# EasyEDA Pro project digiport-gerneral.epro

# Schematic Schematic1
Board Name: digiport-gerneral; Create Date: 2025-06-11; Page Name: P1; Project Name: digiport-general; Schematic Name: Schematic1; Update Date: 2025-06-11; Company: 嘉立创EDA; Page Size: A4; Version: V1.0
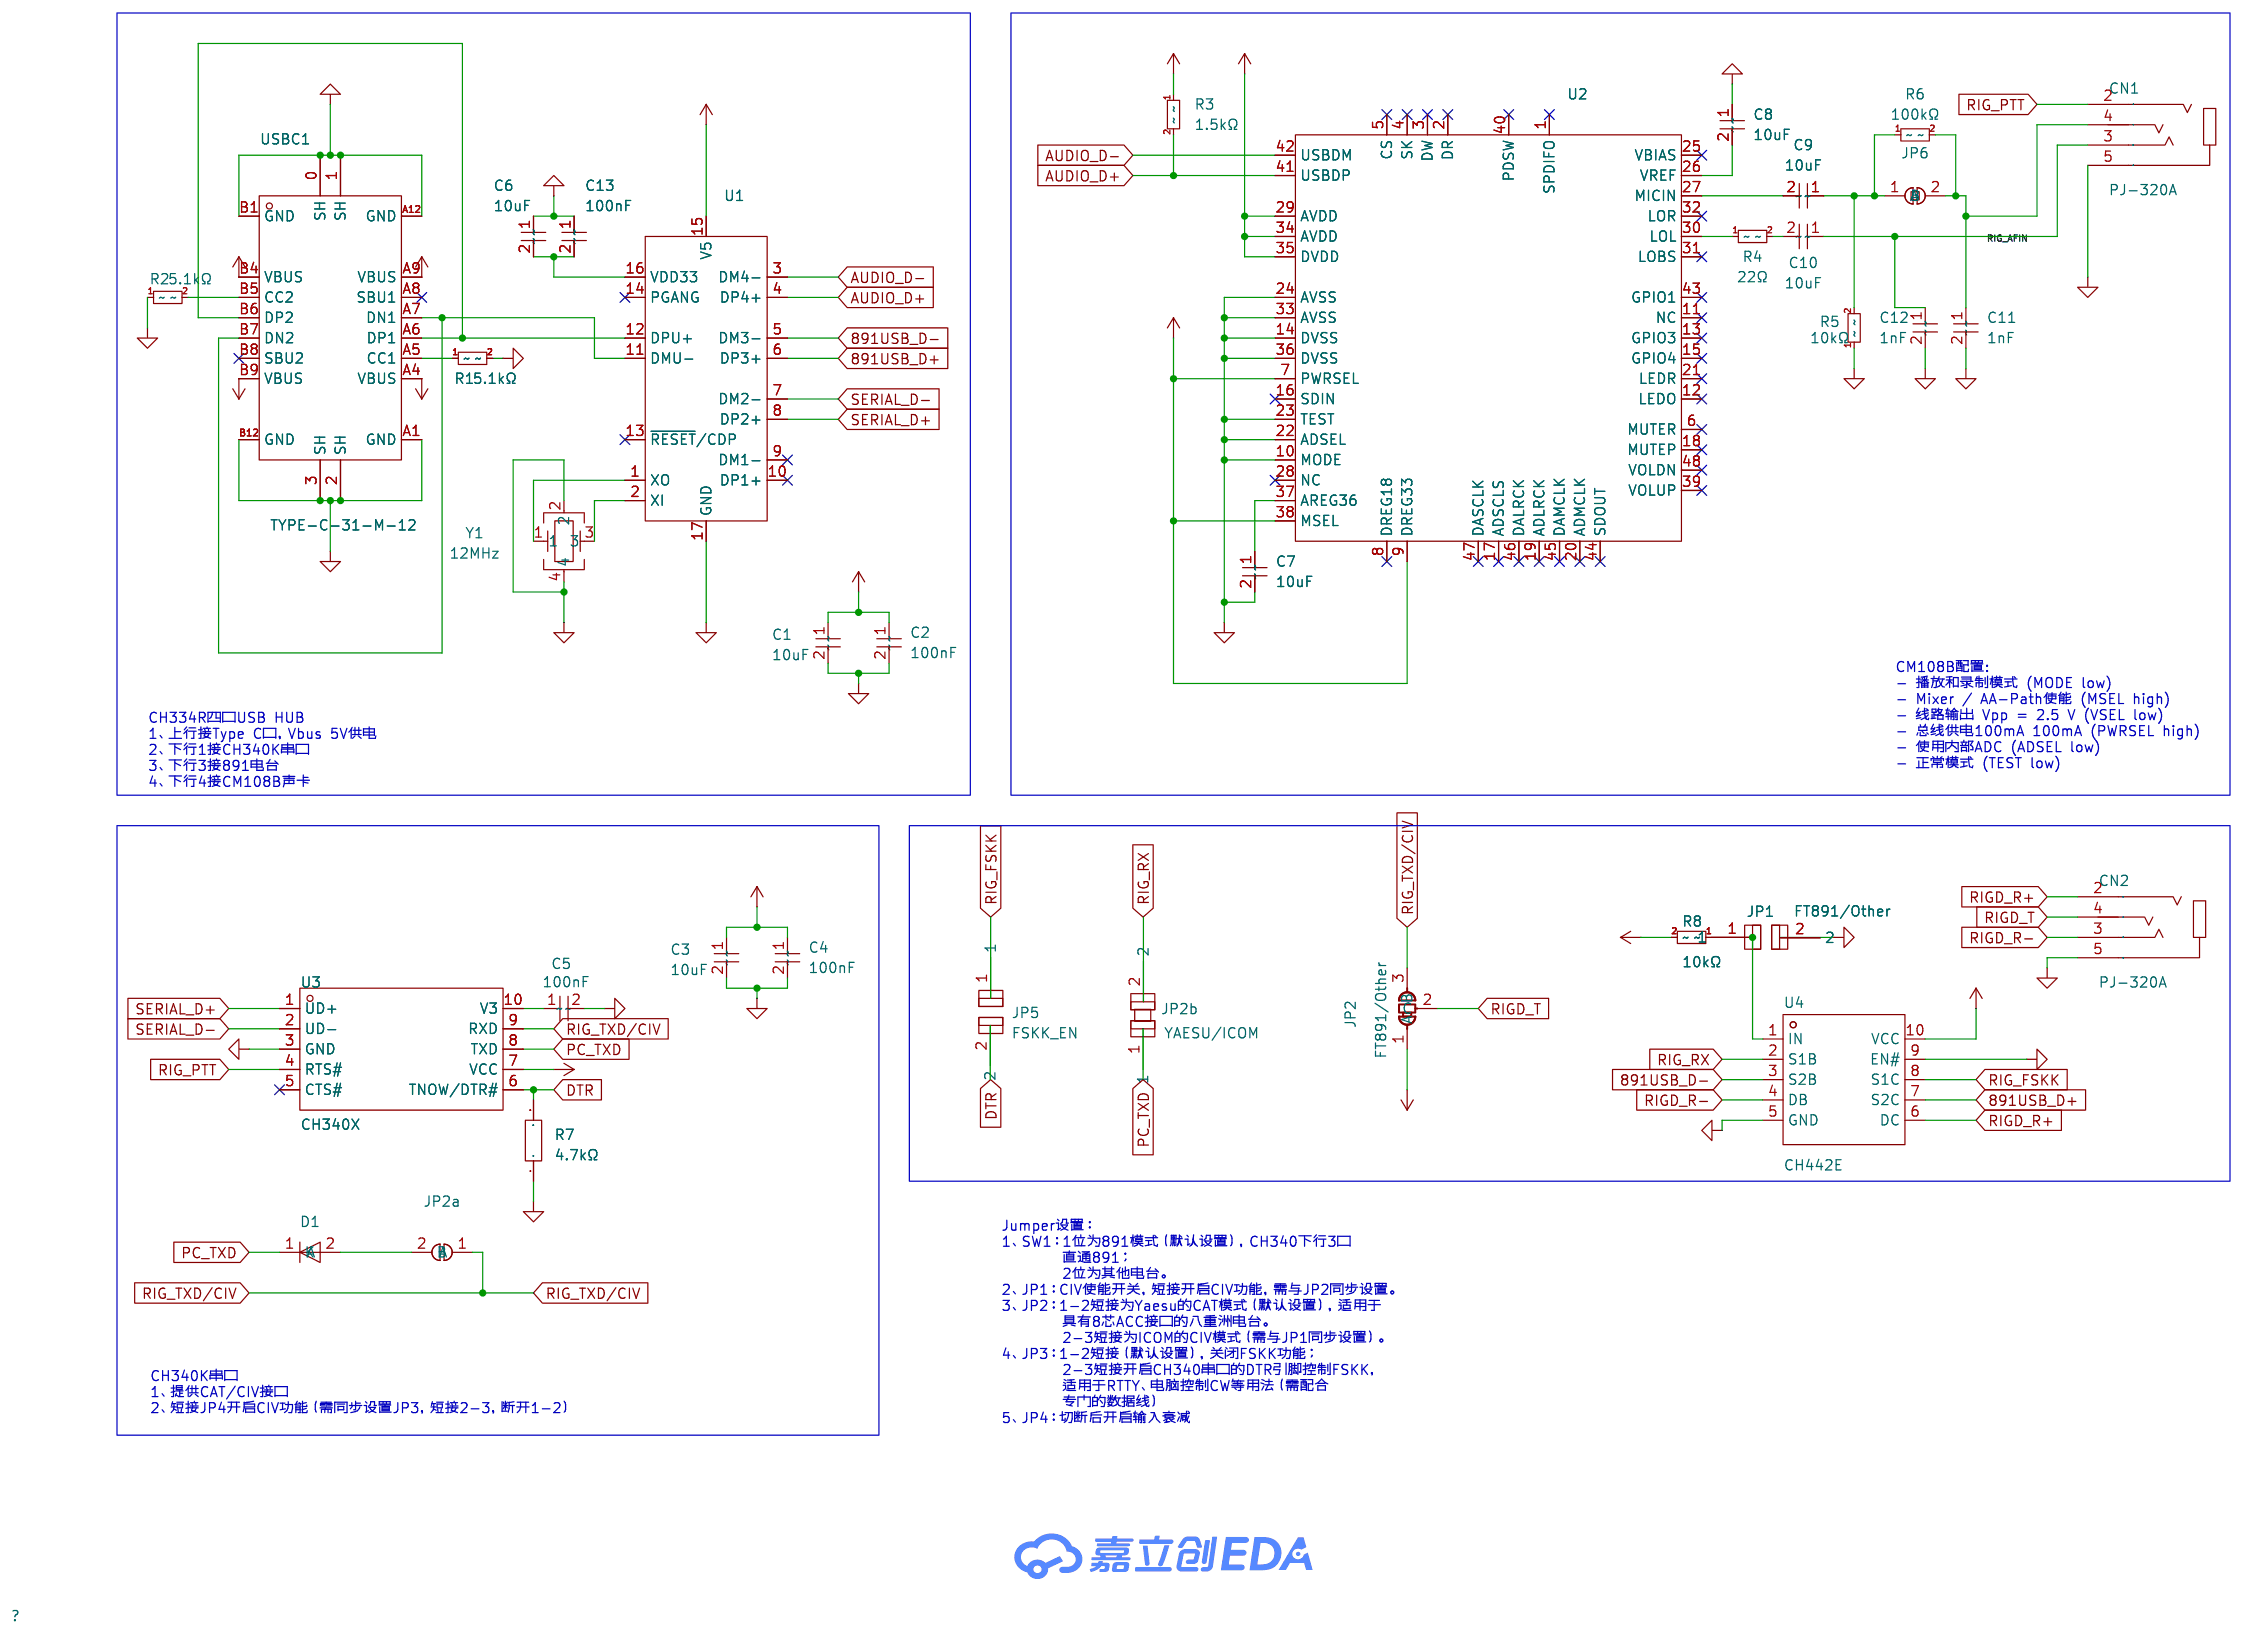
[diagram p0: schematic sheet]

## Parts
C1  10uF  [C0603]
C2  100nF  [C0603]
C3  10uF  [C0603]
C4  100nF  [C0603]
C5  100nF  [C0603]
C6  10uF  [C0603]
C7  10uF  [C0603]
C8  10uF  [C0603]
C9  10uF  [C0603]
C10  10uF  [C0603]
C11  1nF  [C0603]
C12  1nF  [C0603]
C13  100nF  [C0603]
CN1  PJ-320A  [AUDIO-TH_XKB_PJ-320A]
CN2  PJ-320A  [AUDIO-TH_XKB_PJ-320A]
D1  1N4148W-E3-18  [SOD-123_L2.7-W1.6-LS3.7-FD]
JP1  FT891/Other  [SolderJumper2_Open]  (no BOM)
JP2  FSKK_EN  [SolderJumpers3_1&2Bridged]  (no BOM)
JP2a  -  [SolderJumper2_Open]
JP2b  YAESU/ICOM  [SolderJumper2-Bridged]  (no BOM)
JP5  FSKK_EN  [SolderJumper2_Open]  (no BOM)
JP6  -  [SolderJumper2-Bridged]  (no BOM)
R1  5.1kΩ  [R0603]
R2  5.1kΩ  [R0603]
R3  1.5kΩ  [R0603]
R4  22Ω  [R0603]
R5  10kΩ  [R0603]
R6  100kΩ  [R0603]
R7  4.7kΩ  [R0603]
R8  10kΩ  [R0603]
U1  CH334P  [QFN-16_L3.0-W3.0-P0.50-BL-EP1.7]
U2  CM108B  [LQFP-48_L7.0-W7.0-P0.50-LS9.0-BL]
U3  CH340X  [MSOP-10_L3.0-W3.0-P0.50-LS5.0-BL]
U4  CH442E  [MSOP-10_L3.0-W3.0-P0.50-LS5.0-BL]
USBC1  TYPE-C-31-M-12  [USB-C_SMD-TYPE-C-31-M-12]
Y1  12MHz  [CRYSTAL-SMD_4P-L3.2-W2.5-BL]

## Library data of the parts
C1 C3 C6-C10 = GRM188R61E106KA73D: 容值:10uF;精度:±10%;额定电压:25V;材质(温度系数):X5R;; LCSC Part Name: 10uF ±10% 25V; Supplier Part: C344022; Manufacturer: muRata(村田); Supplier Footprint: 0603; JLCPCB Part Class: Extended Part; Datasheet: https://atta.szlcsc.com/upload/public/pdf/source/20181211/C344022_BB98D43E7DA95E5A749FBFE073C8A3E0.pdf; Supplier: LCSC; Tolerance: ±10%; Voltage Rated: 25V; Temperature Coefficient: X5R
C2 C4 C5 C13 = GCJ188R91H104KA01D: 容值:100nF;精度:±10%;额定电压:50V;材质(温度系数):X8R;; LCSC Part Name: 100nF ±10% 50V; Supplier Part: C437421; Manufacturer: muRata(村田); Supplier Footprint: 0603; JLCPCB Part Class: Extended Part; Datasheet: https://atta.szlcsc.com/upload/public/pdf/source/20191016/C437421_7C8D315537458CC8934150722EE6B68F.pdf; Supplier: LCSC; Tolerance: ±10%; Voltage Rated: 50V; Temperature Coefficient: X8R
C11 C12 = GRM1885C1H102JA01D: 容值:1nF;精度:±5%;额定电压:50V;材质(温度系数):C0G;; LCSC Part Name: 1nF ±5% 50V; Supplier Part: C77026; Manufacturer: muRata(村田); Supplier Footprint: 0603; JLCPCB Part Class: Extended Part; Datasheet: https://atta.szlcsc.com/upload/public/pdf/source/20200305/C490387_23319AE8C154DEB24C505E6C82A8106A.pdf; Supplier: LCSC; Tolerance: ±5%; Voltage Rated: 50V; Temperature Coefficient: C0G
CN1 CN2 = PJ-320A: 连接器类型:3.5mm耳机座;额定电流:500mA;额定电压:30V;工作温度范围:-20℃~+70℃;焊接温度(最大值):235℃;; LCSC Part Name: 3.5mm耳机座; Supplier Part: C2884926; Manufacturer: XKB Connectivity(中国星坤); Supplier Footprint: 插件; JLCPCB Part Class: Extended Part; Datasheet: https://atta.szlcsc.com/upload/public/pdf/source/20211009/3530D3239D5E54DF713226555EC23A50.pdf; Supplier: LCSC; Connector Type: 3.5mm耳机座; Current Rating (Max): 500mA; Voltage Rating (Max): 30V; Operating Temperature Range: -20℃~+70℃; Soldering Temperature(Max): 235℃
D1 = 1N4148W-E3-18: 二极管配置:-;正向压降(Vf):1.2V@100mA;直流反向耐压(Vr):75V;平均整流电流(Io):150mA;功率:350mW;反向恢复时间(trr):4ns;; LCSC Part Name: 电压:75V 电流:150mA; Supplier Part: C191428; Manufacturer: VISHAY(威世); Supplier Footprint: SOD-123; JLCPCB Part Class: Extended Part; Datasheet: https://atta.szlcsc.com/upload/public/pdf/source/20180503/C191428_AD0ED457CC768099CBC92C1868282AFA.pdf; Supplier: LCSC; Forward Voltage (Vf@If): 1.2V@100mA; Reverse Voltage (Vr): 75V; Average Rectified Current (Io): 150mA; Power Dissipation: 350mW; Reverse Leakage Current: 100uA@100V; Reverse Recovery Time (trr): 4ns
JP1 JP2a JP5 = SolderJumper2-Open
JP2 = Jumper_SolderJumper_3_Bridged12
JP2b JP6 = SolderJumper2-Bridged
R1 R2 = ERA3AEB512V: 电阻类型:薄膜电阻;阻值:5.1kΩ;精度:±0.1%;功率:100mW;最大工作电压:75V;温度系数:±25ppm/℃;; LCSC Part Name: 5.1kΩ ±0.1% 100mW 薄膜电阻; Supplier Part: C473240; Manufacturer: PANASONIC(松下); Supplier Footprint: 0603; JLCPCB Part Class: Extended Part; Datasheet: https://atta.szlcsc.com/upload/public/pdf/source/20200407/C473240_5B16E09348C571B2A598AE346C03F608.pdf; Supplier: LCSC; Type: 薄膜电阻; Tolerance: ±0.1%; Power(Watts): 100mW; Overload Voltage (Max): 75V; Temperature Coefficient: ±25ppm/℃; Operating Temperature Range: -55℃~+155℃
R3 = ERA3AEB152V: 电阻类型:薄膜电阻;阻值:1.5kΩ;精度:±0.1%;功率:100mW;最大工作电压:75V;温度系数:±25ppm/℃;; LCSC Part Name: 1.5kΩ ±0.1% 100mW 薄膜电阻; Supplier Part: C491115; Manufacturer: PANASONIC(松下); Supplier Footprint: 0603; JLCPCB Part Class: Extended Part; Datasheet: https://atta.szlcsc.com/upload/public/pdf/source/20200407/C491115_63636A060D3E7218AF9C959CC7F7D318.pdf; Supplier: LCSC; Type: 薄膜电阻; Tolerance: ±0.1%; Power(Watts): 100mW; Overload Voltage (Max): 75V; Temperature Coefficient: ±25ppm/℃; Operating Temperature Range: -55℃~+155℃
R4 = ERJPA3F22R0V: 电阻类型:厚膜电阻;阻值:22Ω;精度:±1%;功率:333mW;最大工作电压:-;温度系数:±100ppm/℃;; LCSC Part Name: 22Ω ±1% 333mW 厚膜电阻; Supplier Part: C441911; Manufacturer: PANASONIC(松下); Supplier Footprint: 0603; JLCPCB Part Class: Extended Part; Supplier: LCSC; Type: 厚膜电阻; Tolerance: ±1%; Power(Watts): 333mW; Temperature Coefficient: ±100ppm/℃; Operating Temperature Range: -55℃~+155℃
R5 R8 = ERA3ARB103V: 电阻类型:薄膜电阻;阻值:10kΩ;精度:±0.1%;功率:100mW;最大工作电压:75V;温度系数:±10ppm/℃;; LCSC Part Name: 10kΩ ±0.1% 100mW 薄膜电阻; Supplier Part: C465746; Manufacturer: PANASONIC(松下); Supplier Footprint: 0603; JLCPCB Part Class: Extended Part; Datasheet: https://atta.szlcsc.com/upload/public/pdf/source/20240116/1BF74EFD9CB3CD3C2EC733065CE8BC8C.pdf; Supplier: LCSC; Type: 薄膜电阻; Tolerance: ±0.1%; Power(Watts): 100mW; Overload Voltage (Max): 75V; Temperature Coefficient: ±10ppm/℃; Operating Temperature Range: -55℃~+155℃
R6 = ERJ3EKF1003V: 电阻类型:厚膜电阻;阻值:100kΩ;精度:±1%;功率:100mW;最大工作电压:-;温度系数:±100ppm/℃;; LCSC Part Name: 100kΩ ±1% 100mW 厚膜电阻; Supplier Part: C189597; Manufacturer: PANASONIC(松下); Supplier Footprint: 0603; JLCPCB Part Class: Extended Part; Datasheet: https://atta.szlcsc.com/upload/public/pdf/source/20180524/C193239_FFEA89BB7F9859C8C42240F47AD03C60.pdf; Supplier: LCSC; Type: 厚膜电阻; Tolerance: ±1%; Power(Watts): 100mW; Temperature Coefficient: ±100ppm/℃; Operating Temperature Range: -55℃~+155℃
R7 = ERJPB3B4701V: 电阻类型:厚膜电阻;阻值:4.7kΩ;精度:±0.1%;功率:250mW;最大工作电压:-;温度系数:±50ppm/℃;; LCSC Part Name: 4.7kΩ ±0.1% 250mW 厚膜电阻; Supplier Part: C413738; Manufacturer: PANASONIC(松下); Supplier Footprint: 0603; JLCPCB Part Class: Extended Part; Datasheet: https://atta.szlcsc.com/upload/public/pdf/source/20190821/C413738_E57543BB27A9F77C5AB4607F62EE6601.pdf; Supplier: LCSC; Type: 厚膜电阻; Tolerance: ±0.1%; Power(Watts): 250mW; Temperature Coefficient: ±50ppm/℃; Operating Temperature Range: -55℃~+155℃
U1 = CH334P: CH334和CH335是符合USB2.0协议规范的4端口USBHUB控制器芯片，上行端口支持USB2.0高速和全速，下行端口支持USB2.0高速480Mbps、全速12Mbps和低速1.5Mbps。; Supplier Part: C5373042; Manufacturer: WCH(南京沁恒); Supplier Footprint: QFN-16(3x3); JLCPCB Part Class: Extended Part; Datasheet: https://atta.szlcsc.com/upload/public/pdf/source/20230505/F9D05933C283E82A0686C9413889129E.pdf; Supplier: LCSC; type: 集线器; Protocol: USB 2.0; Data Rate: 480Mbps; Supply Voltage: 3.3V; Operating Temperature: -40℃~+85℃
U2 = CM108B: 高度集成的USB音频芯片 Crystal-less USB audio codec with I2S I/O and Xear driver; LCSC Part Name: Audio Converter Chip; Supplier Part: C371347; Manufacturer: Cmedia(骅讯); Supplier Footprint: LQFP-48(7x7); JLCPCB Part Class: Extended Part; Datasheet: https://atta.szlcsc.com/upload/public/pdf/source/20190215/C371347_139780418F8DFE40697A24CD62AD2CE5.pdf; Supplier: LCSC
U3 = CH340X: Supplier Part: C3035748; Manufacturer: WCH(南京沁恒); Supplier Footprint: MSOP-10; JLCPCB Part Class: 扩展库; Datasheet: https://atta.szlcsc.com/upload/public/pdf/source/20230530/6E401E9554E9F5311886CC8B3F89B62E.pdf; Supplier: LCSC
U4 = CH442E: 开关电路:双刀双掷(DPDT);通道数:2;导通电阻(Ron@VCC):16Ω;; LCSC Part Name: 双刀双掷5V低阻模拟开关芯片CH442E; Supplier Part: C150097; Manufacturer: WCH(南京沁恒); Supplier Footprint: MSOP-10; JLCPCB Part Class: 扩展库; Datasheet: https://atta.szlcsc.com/upload/public/pdf/source/20240313/620B938073BDDE47F846FA583072617B.pdf; Supplier: LCSC; Switch Circuit: 双刀双掷(DPDT); Number of Channels: 2; Supply Voltage: 4V~5.5V; Turn-on time: 7ns; On-State Resistance (Max): 16Ω; Turn-off time: 7ns; Operating Temperature: -40℃~+85℃
USBC1 = TYPE-C-31-M-12: 连接器类型:Type-C;标准:-;公母:母;安装方式:-;触点数量:16P;端口数量:1;额定电流 - 电源:5A;工作温度范围:-;; LCSC Part Name: Type-C 母; Supplier Part: C165948; Manufacturer: 韩国韩荣; Supplier Footprint: SMD; JLCPCB Part Class: Extended Part; Datasheet: https://atta.szlcsc.com/upload/public/pdf/source/20220525/466408E853115E789EDB0DDC29077C05.pdf; Supplier: LCSC; Connector Type: Type-C; Gender: 母; Number of Contacts: 16P; Number of Ports: 1; Current Rating - Power (Max): 5A
Y1 = CF4012M00012001: 晶振类型:贴片晶振;频率:12MHz;常温频差:±10ppm;负载电容:12pF;频率稳定度:±30ppm;; LCSC Part Name: 12MHz ±10ppm 12pF; Supplier Part: C7294550; Manufacturer: HUAXIN(华昕); Supplier Footprint: SMD-3225-4P; JLCPCB Part Class: Extended Part; Datasheet: https://atta.szlcsc.com/upload/public/pdf/source/20230614/3722586679DD390FF3DAA05DC65F5BC0.pdf; Supplier: LCSC; Type: 贴片晶振; Normal temperature Frequency Tolerance: ±10ppm; Load Capacitance: 12pF; Frequency Stability: ±30ppm; Equivalent Series Resistance(ESR): 40Ω; Operating Temperature: -40℃~+85℃

## Nets
891USB_D+: U1.6(DP3+) U4.7(S2C)
891USB_D-: U1.5(DM3-) U4.3(S2B)
AUDIO_D+: R3.2 U1.4(DP4+) U2.41(USBDP)
AUDIO_D-: U1.3(DM4-) U2.42(USBDM)
DTR: JP5.2 R7.2 U3.6(TNOW/DTR#)
PC_TXD: D1.1(K) JP2b.1 U3.8(TXD)
POWER_+3.3V: C3.1 C4.1 R3.1 U2.7(PWRSEL) U2.9(DREG33) U2.38(MSEL)
POWER_+5V: C1.1 C2.1 JP2.1(A) R8.2 U1.15(V5) U2.29(AVDD) U2.34(AVDD) U2.35(DVDD) U3.7(VCC) U4.10(VCC) USBC1.A4(VBUS) USBC1.A9(VBUS) USBC1.B4(VBUS) USBC1.B9(VBUS)
POWER_GND: C1.2 C2.2 C3.2 C4.2 C5.2 C6.1 C7.2 C8.1 C11.2 C12.2 C13.1 CN1.5 CN2.5 R1.2 R2.1 R5.1 R7.1 U1.17(GND) U2.10(MODE) U2.14(DVSS) U2.22(ADSEL) U2.23(TEST) U2.24(AVSS) U2.33(AVSS) U2.36(DVSS) U3.3(GND) U4.5(GND) U4.9(EN#) USBC1.0(SH) USBC1.1(SH) USBC1.2(SH) USBC1.3(SH) USBC1.A1(GND) USBC1.A12(GND) USBC1.B1(GND) USBC1.B12(GND) Y1.2 Y1.4
RIG_AFIN: C10.1 C12.1 CN1.3
RIG_FSKK: JP5.1 U4.8(S1C)
RIG_PTT: CN1.2 U3.4(RTS#)
RIG_RX: JP2b.2 U4.2(S1B)
RIG_TXD/CIV: JP2.3(B) JP2a.1(A) U3.9(RXD)
RIGD_R+: CN2.2 U4.6(DC)
RIGD_R-: CN2.3 U4.4(DB)
RIGD_T: CN2.4 JP2.2(C)
SERIAL_D+: U1.8(DP2+) U3.1(UD+)
SERIAL_D-: U1.7(DM2-) U3.2(UD-)
$1N2280: C6.2 C13.2 U1.16(VDD33)
$1N2319: C8.2 U2.26(VREF)
$1N2326: C11.1 CN1.4 JP6.2(B) R6.2
$1N2338: C7.1 U2.37(AREG36)
$1N2355: C9.1 JP6.1(A) R5.2 R6.1
$1N2364: D1.2(A) JP2a.2(B)
$1N2394: U1.1(XO) Y1.1
$1N2405: U1.2(XI) Y1.3
$1N2431: R4.1 U2.30(LOL)
$1N2435: C9.2 U2.27(MICIN)
$1N2439: C5.1 U3.10(V3)
$1N2449: C10.2 R4.2
$1N2474: U1.12(DPU+) USBC1.A6(DP1) USBC1.B6(DP2)
$1N2475: R2.2 USBC1.B5(CC2)
$1N2477: R1.1 USBC1.A5(CC1)
$1N2478: U1.11(DMU-) USBC1.A7(DN1) USBC1.B7(DN2)
$1N8912: JP1.1 R8.1 U4.1(IN)

Not connected (* = marked no-connect by the designer): JP1 2; U1 9(DM1-)* 10(DP1+)* 13(~{RESET}/CDP)* 14(PGANG)*; U2 1(SPDIFO)* 2(DR)* 3(DW)* 4(SK)* 5(CS)* 6(MUTER)* 8(DREG18)* 11(NC)* 12(LEDO)* 13(GPIO3)* 15(GPIO4)* 16(SDIN)* 17(ADSCLS)* 18(MUTEP)* 19(ADLRCK)* 20(ADMCLK)* 21(LEDR)* 25(VBIAS)* 28(NC)* 31(LOBS)* 32(LOR)* 39(VOLUP)* 40(PDSW)* 43(GPIO1)* 44(SDOUT)* 45(DAMCLK)* 46(DALRCK)* 47(DASCLK)* 48(VOLDN)*; U3 5(CTS#)*; USBC1 A8(SBU1)* B8(SBU2)*

## Notes on the sheet
- CM108B配置:
  - 播放和录制模式 (MODE low)
  - Mixer / AA-Path使能 (MSEL high)
  - 线路输出 Vpp = 2.5 V (VSEL low)
  - 总线供电100mA 100mA (PWRSEL high)
  - 使用内部ADC (ADSEL low)
  - 正常模式 (TEST low)
- CH334R四口USB HUB
  1、上行接Type C口，Vbus 5V供电
  2、下行1接CH340K串口
  3、下行3接891电台
  4、下行4接CM108B声卡
- Jumper设置：
  1、SW1：1位为891模式（默认设置），CH340下行3口
          直通891；
          2位为其他电台。
  2、JP1：CIV使能开关，短接开启CIV功能，需与JP2同步设置。
  3、JP2：1-2短接为Yaesu的CAT模式（默认设置），适用于
          具有8芯ACC接口的八重洲电台。
          2-3短接为ICOM的CIV模式（需与JP1同步设置）。
  4、JP3：1-2短接（默认设置），关闭FSKK功能；
          2-3短接开启CH340串口的DTR引脚控制FSKK，
          适用于RTTY、电脑控制CW等用法（需配合
          专门的数据线）
  5、JP4：切断后开启输入衰减
- CH340K串口
  1、提供CAT/CIV接口
  2、短接JP4开启CIV功能（需同步设置JP3，短接2-3，断开1-2）

# Board digiport-gerneral
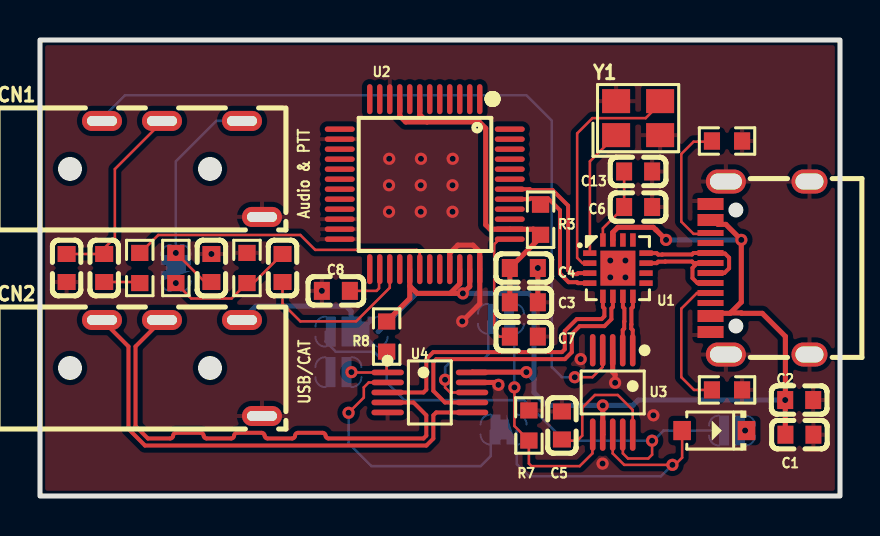
[diagram p1: board, top side]
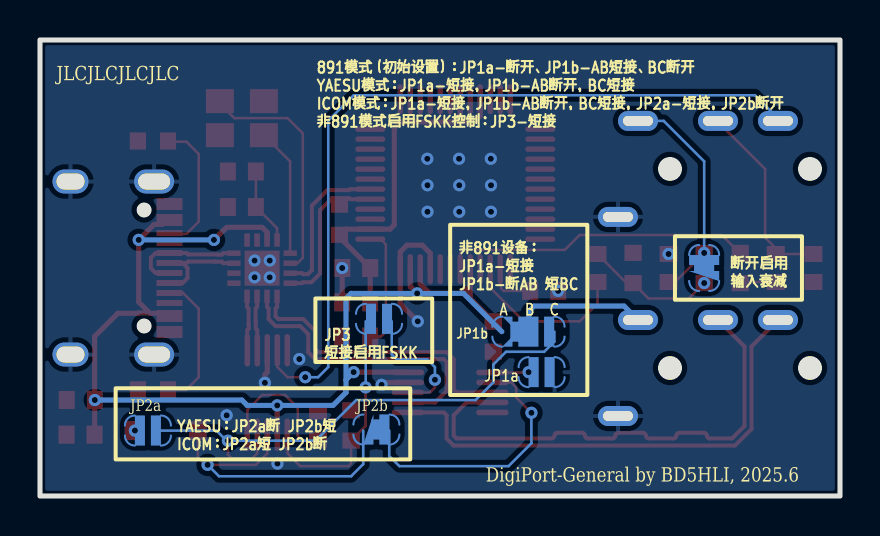
[diagram p2: board, bottom side, seen from below]

Outline 40 x 22.8 mm; copper layers: Top Layer, Bottom Layer. Coordinates in mm from the lower left corner of the outline.
Outline path: rectangle 0,22.8 40,0
Stack: Top Layer 0.035mm / Dielectric1 1.51mm FR4 er 4.5 / Bottom Layer 0.035mm

## Design rules (mm)
net POWER_GND: Power
net POWER_+5V: Power
net POWER_+3.3V: Power
net $1N2439: Default
net $1N2280: Default
net $1N2338: Default
net $1N2319: Default
net $1N2435: Default
net $1N2355: Default
net $1N2449: Default
net RIG_AFIN: Default
net $1N2326: Default
net RIG_PTT: Default
net RIGD_R+: Differential, RIG
net RIGD_R-: Differential, RIG
net RIGD_T: Default
net PC_TXD: Default
net $1N2364: Default
net RIG_TXD/CIV: Default
net RIG_FSKK: Default
net $1N8912: Default
net $1N2477: Default
net $1N2475: Default
net AUDIO_D+: Differential, AUDIO
net $1N2431: Default
net $1N2394: Default
net $1N2405: Default
net AUDIO_D-: Differential, AUDIO
net SERIAL_D-: Differential, SERIAL
net SERIAL_D+: Differential, SERIAL
net 891USB_D-: Differential, FT891
net 891USB_D+: Differential, FT891
net $1N2478: Differential, USB-UP
net $1N2474: Differential, USB-UP
template: 自定义配置
spacing copperThickness1oz (default): track to track 0.102, other pairs 0.152 to 0.3
spacing copperThickness2oz: track to track 0.203, other pairs 0.152 to 0.3
spacing SolderJumper: track to track 0.152, other pairs 0 to 0.3
track width copperThickness1oz (default): min 0.127, default 0.254, max 2.54
track width copperThickness2oz: min 0.203, default 0.254, max 2.54
track width 0.127mm: min 0.127, default 0.127, max 0.254
track width 0.2mm: min 0.2, default 0.2, max 0.2
track width 0.254mm: min 0.254, default 0.254, max 0.254
differential pair differentialPair (default): width min 0.127, default 0.254, max 2.54; gap min 0.152, default 0.152
via viaSize (default): diameter min 0.5, default 0.61, max 10; hole min 0.3, default 0.305, max 6.3
net class Power uses 0.254mm
net class Default uses 0.127mm
net class Differential uses 0.2mm
net POWER_GND uses 0.254mm
net POWER_+5V uses 0.254mm
net POWER_+3.3V uses 0.254mm
net $1N2439 uses 0.127mm
net $1N2280 uses 0.127mm
net $1N2338 uses 0.127mm
net $1N2319 uses 0.127mm
net $1N2435 uses 0.127mm
net $1N2355 uses 0.127mm
net $1N2449 uses 0.127mm
net RIG_AFIN uses 0.127mm
net $1N2326 uses 0.127mm
net RIG_PTT uses 0.127mm
net RIGD_R+ uses 0.2mm
net RIGD_R- uses 0.2mm
net RIGD_T uses 0.127mm
net PC_TXD uses 0.127mm
net $1N2364 uses 0.127mm
net RIG_TXD/CIV uses 0.127mm
net RIG_FSKK uses 0.127mm
net $1N8912 uses 0.127mm
net $1N2477 uses 0.127mm
net $1N2475 uses 0.127mm
net AUDIO_D+ uses 0.2mm
net $1N2431 uses 0.127mm
net $1N2394 uses 0.127mm
net $1N2405 uses 0.127mm
net AUDIO_D- uses 0.2mm
net SERIAL_D- uses 0.2mm
net SERIAL_D+ uses 0.2mm
net 891USB_D- uses 0.2mm
net 891USB_D+ uses 0.2mm
net $1N2478 uses 0.2mm
net $1N2474 uses 0.2mm
region e1007 uses SolderJumper
region e1008 uses SolderJumper
region e1009 uses SolderJumper
region e131 uses SolderJumper

## Placement (name value [footprint] x y rotation side)
C1  10uF  [C0603]  37.97 3.07 0 top
C2  100nF  [C0603]  37.96 4.8 0 top
C3  10uF  [C0603]  24.19 9.69 0 top
C4  100nF  [C0603]  24.19 11.4 0 top
C5  100nF  [C0603]  26.1 3.53 90 top
C6  10uF  [C0603]  29.91 14.45 180 top
C7  10uF  [C0603]  24.19 7.97 0 top
C8  10uF  [C0603]  14.79 10.26 0 top
C9  10uF  [C0603]  12.13 11.4 270 top
C10  10uF  [C0603]  3.21 11.4 270 top
C11  1nF  [C0603]  8.57 11.4 90 top
C12  1nF  [C0603]  1.33 11.4 270 top
C13  100nF  [C0603]  29.91 16.23 180 top
CN1  PJ-320A  [AUDIO-TH_XKB_PJ-320A]  7.1 16.35 0 top
CN2  PJ-320A  [AUDIO-TH_XKB_PJ-320A]  7.1 6.4 0 top
D1  1N4148W-E3-18  [SOD-123_L2.7-W1.6-LS3.7-FD]  33.72 3.27 0 top
JP1  FT891/Other  [SolderJumper2_Open]  14.92 6.19 180 bottom
JP1b  -  [SolderJumpers3_1&2Bridged]  15.58 8.22 180 bottom
JP2a  -  [SolderJumper2_Open]  34.6 3.27 0 bottom
JP2b  YAESU/ICOM  [SolderJumper2-Bridged]  23.18 3.32 180 bottom
JP5  FSKK_EN  [SolderJumper2_Open]  23.05 8.86 0 bottom
JP6  -  [SolderJumper2-Bridged]  6.79 11.4 90 bottom
R1  5.1kΩ  [R0603]  34.35 5.3 0 top
R2  5.1kΩ  [R0603]  34.35 17.75 180 top
R3  1.5kΩ  [R0603]  25.03 13.81 90 top
R4  22Ω  [R0603]  4.99 11.4 270 top
R5  10kΩ  [R0603]  10.35 11.4 270 top
R6  100kΩ  [R0603]  6.79 11.4 90 top
R7  4.7kΩ  [R0603]  24.44 3.53 270 top
R8  10kΩ  [R0603]  17.33 7.97 90 top
U1  CH334P  [QFN-16_L3.0-W3.0-P0.50-BL-EP1.7]  28.9 11.39 270 top
U2  CM108B  [LQFP-48_L7.0-W7.0-P0.50-LS9.0-BL]  19.24 15.59 180 top
U3  CH340X  [MSOP-10_L3.0-W3.0-P0.50-LS5.0-BL]  28.64 5.18 180 top
U4  CH442E  [MSOP-10_L3.0-W3.0-P0.50-LS5.0-BL]  19.49 5.18 270 top
USBC1  TYPE-C-31-M-12  [USB-C_SMD-TYPE-C-31-M-12]  36 11.4 90 top
Y1  12MHz  [CRYSTAL-SMD_4P-L3.2-W2.5-BL]  29.91 18.89 0 top

## Footprints (pads in the part's own frame, mm; a bottom-side part is the same pattern mirrored in y, then rotated)
AUDIO-TH_XKB_PJ-320A
  oval 2x1 hole 1.5x0.5: 2(-4,2.4) 3(-1,2.4) 4(3,2.4) 5(4,-2.4)
C0603
  rect 0.8x0.9 smd: 1(-0.7,0) 2(0.7,0)
CRYSTAL-SMD_4P-L3.2-W2.5-BL
  rect 1.4x1.2 smd: 1(-1.1,-0.85) 2(1.1,-0.85) 3(1.1,0.85) 4(-1.1,0.85)
LQFP-48_L7.0-W7.0-P0.50-LS9.0-BL
  oval 0.27x1.5 smd: 1(-2.75,-4.25) 2(-2.25,-4.25) 3(-1.75,-4.25) 4(-1.25,-4.25) 5(-0.75,-4.25) 6(-0.25,-4.25) 7(0.25,-4.25) 8(0.75,-4.25) 9(1.25,-4.25) 10(1.75,-4.25) 11(2.25,-4.25) 12(2.75,-4.25) 25(2.75,4.25) 26(2.25,4.25) 27(1.75,4.25) 28(1.25,4.25) 29(0.75,4.25) 30(0.25,4.25) 31(-0.25,4.25) 32(-0.75,4.25) 33(-1.25,4.25) 34(-1.75,4.25) 35(-2.25,4.25) 36(-2.75,4.25)
  oval 1.5x0.27 smd: 13(4.25,-2.75) 14(4.25,-2.25) 15(4.25,-1.75) 16(4.25,-1.25) 17(4.25,-0.75) 18(4.25,-0.25) 19(4.25,0.25) 20(4.25,0.75) 21(4.25,1.25) 22(4.25,1.75) 23(4.25,2.25) 24(4.25,2.75) 37(-4.25,2.75) 38(-4.25,2.25) 39(-4.25,1.75) 40(-4.25,1.25) 41(-4.25,0.75) 42(-4.25,0.25) 43(-4.25,-0.25) 44(-4.25,-0.75) 45(-4.25,-1.25) 46(-4.25,-1.75) 47(-4.25,-2.25) 48(-4.25,-2.75)
MSOP-10_L3.0-W3.0-P0.50-LS5.0-BL
  oval 0.28x1.62 smd: 1(-1,-2.11) 2(-0.5,-2.11) 3(0,-2.11) 4(0.5,-2.11) 5(1,-2.11) 6(1,2.11) 7(0.5,2.11) 8(0,2.11) 9(-0.5,2.11) 10(-1,2.11)
QFN-16_L3.0-W3.0-P0.50-BL-EP1.7
  rect 0.28x0.665 smd: 1(-0.75,-1.407) 2(-0.25,-1.407) 3(0.25,-1.407) 4(0.75,-1.407) 9(0.75,1.407) 10(0.25,1.407) 11(-0.25,1.407) 12(-0.75,1.407)
  rect 0.665x0.28 smd: 5(1.407,-0.75) 6(1.407,-0.25) 7(1.407,0.25) 8(1.407,0.75) 13(-1.407,0.75) 14(-1.407,0.25) 15(-1.407,-0.25) 16(-1.407,-0.75)
  rect 1.75x1.75 smd: 17(0,0)
R0603
  rect 0.806x0.864 smd: 1(-0.753,0) 2(0.753,0)
SOD-123_L2.7-W1.6-LS3.7-FD
  rect 0.88x0.96 smd: 1(-1.61,0) 2(1.61,0)
SolderJumper2-Bridged
  custom 1x1.5 smd: 1(-0.65,0) 2(0.65,0)
SolderJumper2_Open
  custom 1x1.5 smd: 1(-0.65,0) 2(0.65,0)
SolderJumpers3_1&2Bridged
  custom 1x1.5 smd: 1(-1.3,0)
  rect 1x1.5 smd: 2(0,0)
  custom 1.018x1.5 smd: 3(1.3,0)
USB-C_SMD-TYPE-C-31-M-12
  oval 1.2x2 hole 0.8x1.6: 0(-4.325,1.706) 1(4.325,1.706)
  oval 1.2x1.8 hole 0.8x1.4: 2(4.325,-2.474) 3(-4.325,-2.474)
  rect 0.3x1.3 smd: A1(-3.35,2.474) A4(-2.55,2.474) A5(-1.25,2.474) A6(-0.25,2.474) A7(0.25,2.474) A8(1.25,2.474) A9(2.55,2.474) A12(3.35,2.474) B1(3.05,2.474) B4(2.25,2.474) B5(1.75,2.474) B6(0.75,2.474) B7(-0.75,2.474) B8(-1.75,2.474) B9(-2.25,2.474) B12(-3.05,2.474)

## Nets
As in the schematic, except:
POWER_+5V: C1.1 C2.1 JP1b.1 R8.2 U1.15 U2.29 U2.34 U2.35 U3.7 U4.10 USBC1.A4 USBC1.A9 USBC1.B4 USBC1.B9
POWER_GND: C1.2 C2.2 C3.2 C4.2 C5.2 C6.1 C7.2 C8.1 C11.2 C12.2 C13.1 CN1.5 CN2.5 JP1.2 R1.2 R2.1 R5.1 R7.1 U1.17 U2.10 U2.14 U2.22 U2.23 U2.24 U2.33 U2.36 U3.3 U4.5 U4.9 USBC1.0 USBC1.1 USBC1.2 USBC1.3 USBC1.A1 USBC1.A12 USBC1.B1 USBC1.B12 Y1.2 Y1.4
RIG_TXD/CIV: JP1b.3 JP2a.1 U3.9
RIGD_T: CN2.4 JP1b.2

Pads without a net: U1 9 10 13 14; U2 1 2 3 4 5 6 8 11 12 13 15 16 17 18 19 20 21 25 28 31 32 39 40 43 44 45 46 47 48; U3 5; USBC1 A8 B8

## Via types
v1: diameter 0.61, hole 0.305, Top Layer to Bottom Layer, 38 vias

## Routing (per net, layer and track width the routed paths; a pad name or vN(x,y) marks a point on that pad's centre or on a via; arc(x,y) is an arc through that point)
891USB_D+: length 15.1
  Top Layer w0.2: U1.6 28.65,9.45 28.57,9.38 28.57,8.84 28.22,8.49 26.99,8.49 26.59,8.1 26.59,7.19 26.24,6.84 19.81,6.84 19.67,6.7 19.67,5.26 20.25,4.68 U4.7
891USB_D-: length 14.9
  Top Layer w0.2: U4.3 19.17,5.18 19.32,5.32 19.32,6.85 19.66,7.2 26.1,7.2 26.24,7.34 26.24,8.24 26.84,8.85 28.08,8.85 28.22,8.99 28.22,9.38 28.15,9.45 U1.5
AUDIO_D+: length 7.6
  Top Layer w0.2: U2.41 24.49,14.84 24.54,14.89 25.4,14.89 26,14.29 26,11.12 26.43,10.69 26.85,10.69 26.9,10.64 U1.4
AUDIO_D-: length 7.7
  Top Layer w0.2: U2.42 24.49,15.34 24.54,15.29 25.63,15.29 26.4,14.52 26.4,11.29 26.6,11.09 26.85,11.09 26.9,11.14 U1.3
DTR: length 11.6
  Top Layer w0.127: v1(23.72,5.43) 23.72,3.5 R7.2 ; U3.6 27.62,3.05 27.62,2.13 26.99,1.49 24.57,1.49 24.44,1.62 24.44,2.5
  Bottom Layer w0.127: v1(23.72,5.43) 23.71,5.44 23.71,8.73
PC_TXD: length 16.1
  Top Layer w0.127: D1.1 32.11,1.92 31.75,1.56 v1(31.62,1.56) 29.21,1.56 28.64,2.13 U3.8
  Bottom Layer w0.127: v1(31.62,1.56) 31.05,0.99 24.44,0.99 23.84,1.59 23.84,3.27
POWER_+3.3V: length 18.5
  Top Layer w0.254: 19.35,18.7 21.97,18.7 22.29,18.39 22.29,13.56 22.5,13.34 U2.38 24.67,13.34 25.08,12.93 25.02,12.93 C4.1 C3.1 ; 19.35,18.7 18.29,18.7 17.99,19 U2.9 ; 19.35,18.7 18.99,19.07 U2.7
POWER_+5V: length 61.2
  Top Layer w0.254: 34.01,9.13 34.5,9.13 34.52,9.15 ; U3.7 28.14,3.07 v1(28.14,4.53) ; 18.49,10.5 18.49,9.88 R8.2 ; 18.49,10.5 18.86,10.13 20.51,10.13 ; 18.49,10.5 U2.29 ; 20.51,10.13 20.99,10.61 U2.34 ; 20.51,10.13 v1(21.14,10.13) 21.49,10.48 U2.35 ; 37.27,4.86 37.27,7.98 36.11,9.13 35.09,9.13 35.06,9.15 34.52,9.15 ; v1(31.3,12.81) 30.8,13.31 30.79,13.31 30.67,13.43 28.89,13.43 28.64,13.18 28.64,12.81 U1.15 ; 34.52,9.15 35.06,9.7 v1(35.06,12.81) 34.29,13.58 33.9,13.58 USBC1.A9 ; v1(24.32,6.19) 21.62,6.19 U4.10 ; 37.26,4.7 37.26,3.13
  Bottom Layer w0.254: v1(37.26,4.8) 29.91,4.8 29.64,4.53 v1(28.14,4.53) 25.35,4.53 24.7,5.18 24.7,5.81 ; 24.7,5.81 v1(24.32,6.19) ; 24.7,5.81 24.7,9.88 24.44,10.13 v1(21.14,10.13) 18.82,10.13 16.91,8.22 ; v1(35.06,12.81) v1(31.3,12.81)
POWER_GND: length 11.2
  Top Layer w0.254: U4.9 22.8,5.68 v1(22.92,5.56) ; C3.2 v1(24.89,11.4) ; v1(28.76,5.66) 28.76,6.07 28.64,6.19 U3.3 ; v1(21.11,8.73) 21.99,9.61 U2.36 21.99,12.21 21.65,12.54 20.89,12.54 20.49,12.14 U2.33
  vias: v1(8.57,12.1) v1(14.09,10.26) v1(17.46,16.86) v1(17.45,15.54) v1(17.45,14.21) v1(19.05,16.86) v1(19.04,15.54) v1(19.04,14.21) v1(20.63,16.86) v1(20.63,15.54) v1(20.63,14.21) v1(27.03,6.85) v1(28.13,1.62) v1(28.51,11.77) v1(28.51,10.93) v1(29.27,11.77) v1(29.27,10.93) v1(30.67,4.03)
RIG_AFIN: length 9.7
  Top Layer w0.127: C12.1 3.2,12.1 3.2,12.38 3.74,12.92 3.74,16.35 6.15,18.75
RIG_FSKK: length 6.5
  Top Layer w0.127: v1(20.25,5.81) 20.25,5.43 20.51,5.18 U4.8
  Bottom Layer w0.127: v1(20.25,5.81) 20.25,6.45 20.63,6.83 22.16,6.83 22.41,7.08 22.41,8.73
RIG_PTT: length 39.7
  Top Layer w0.127: v1(26.74,5.94) 27.62,5.94 28.14,6.46 U3.4
  Bottom Layer w0.127: v1(26.74,5.94) 26.1,5.94 25.59,6.45 25.59,18.77 24.32,20.04 4.25,20.04 3.15,18.93 3.15,18.75
RIG_RX: length 13.5
  Top Layer w0.127: U4.2 16.44,5.68 16.19,5.43 16.19,4.92 v1(15.43,4.16)
  Bottom Layer w0.127: v1(15.43,4.16) 15.43,2.64 16.57,1.49 22.03,1.49 22.54,2 22.54,3.27
RIG_TXD/CIV: length 26.2
  Top Layer w0.127: v1(30.6,2.76) 30.6,2.07 30.41,1.88 29.4,1.88 29.14,2.13 29.14,3.06 U3.9
  Bottom Layer w0.127: JP1b.3 14.28,7.72 14.79,7.21 16.7,7.21 17.33,6.57 17.33,5.69 18.22,4.8 24.19,4.8 26.22,2.76 v1(30.6,2.76) 30.67,2.76 31.18,3.27 33.96,3.27
RIGD_R+: length 24.9
  Top Layer w0.2: CN2.2 4.42,7.48 4.42,3.35 5.25,2.52 19.32,2.52 19.67,2.87 19.67,4.04 19.81,4.18 U4.6
RIGD_R-: length 24.9
  Top Layer w0.2: CN2.3 4.78,7.48 4.78,3.5 5.4,2.88 6.52,2.88 arc(6.62,2.92) 6.66,3.02 arc(6.7,3.12) 6.8,3.16 8.04,3.16 arc(8.14,3.12) 8.18,3.02 arc(8.22,2.92) 8.32,2.88 9.56,2.88 arc(9.66,2.92) 9.71,3.02 arc(9.75,3.12) 9.85,3.16 11.09,3.16 arc(11.19,3.12) 11.23,3.02 arc(11.27,2.92) 11.37,2.88 12.61,2.88 arc(12.71,2.92) 12.75,3.02 arc(12.8,3.12) 12.9,3.16 14.14,3.16 arc(14.24,3.12) 14.28,3.02 arc(14.32,2.92) 14.42,2.88 19.17,2.88 19.32,3.02 19.32,4.04 18.67,4.68 U4.4
RIGD_T: length 6.9
  Bottom Layer w0.254: CN2.4 10.79,9.5 15.3,9.5 15.56,9.24 15.56,8.24 JP1b.2
SERIAL_D+: length 2.8
  Top Layer w0.2: U1.8 29.65,9.45 29.57,9.38 29.57,8.58 29.56,8.57 29.56,8.37 29.64,8.3 U3.1
SERIAL_D-: length 2.8
  Top Layer w0.2: U3.2 29.14,8.3 29.21,8.37 29.21,8.72 29.22,8.73 29.22,9.38 29.15,9.45 U1.7
$1N2280: length 3.9
  Top Layer w0.127: C13.2 C6.2 28.15,13.39 U1.16
$1N2319: length 2.2
  Top Layer w0.127: 15.75,10.26 16.82,10.26 16.95,10.38 16.95,11.31 U2.26
$1N2326: length 11.3
  Top Layer w0.127: C11.1 8.25,10.7 v1(6.79,12.15)
  Bottom Layer w0.127: 10.15,18.75 8.81,18.75 6.79,16.73 JP6.2
$1N2338: length 6.1
  Top Layer w0.127: C7.1 22.97,7.97 22.71,8.23 22.71,12.59 22.97,12.84 U2.37
$1N2355: length 6.6
  Top Layer w0.127: v1(6.79,10.65) 7.56,9.88 9.58,9.88 R5.2 10.67,10.65 C9.1
$1N2364:
  vias: v1(35.25,3.27)
$1N2394: length 6.4
  Top Layer w0.127: Y1.1 27.5,16.73 27.5,12.15 U1.1
$1N2405: length 11.9
  Top Layer w0.127: U1.2 27.12,11.64 26.86,11.91 26.86,18.13 27.62,18.89 30.28,18.89 31.01,19.62 31.01,19.74
$1N2431: length 15.5
  Top Layer w0.127: 5.01,12.15 5.91,13.05 13.01,13.05 13.76,12.31 18.84,12.31 18.99,12.16 U2.30
$1N2435: length 8.4
  Top Layer w0.127: C9.2 12.13,9.62 13.01,8.73 15.81,8.73 17.49,10.41 U2.27
$1N2439: length 7.2
  Top Layer w0.127: 25.84,3.08 26.16,2.76 26.86,2.76 27.11,3.02 27.11,4.42 27.75,5.05 28.89,5.05 29.64,4.3 U3.10
$1N2449: length 1.8
  Top Layer w0.127: 5.01,10.65 4.96,10.7 3.2,10.7
$1N2474: length 5.3
  Top Layer w0.2: USBC1.B6 32.68,12.15 32.6,12.08 31.12,12.08 31.11,12.07 30.91,12.07 30.84,12.14 U1.12 ; 34.11,12.12 34.25,12.12 34.46,11.92 34.46,11.38 34.22,11.15 USBC1.A6
$1N2475: length 7
  Top Layer w0.127: 33.73,13.11 32.68,13.11 32.06,13.72 32.06,17.1 32.68,17.71 33.53,17.71
$1N2477: length 7
  Top Layer w0.127: USBC1.A5 32.85,10.15 32.06,9.37 32.06,5.94 32.7,5.3 R1.1
$1N2478: length 5.1
  Top Layer w0.2: USBC1.A7 32.68,11.65 32.6,11.72 31.26,11.72 31.25,11.72 30.91,11.72 30.84,11.64 U1.11 ; 32.84,11.62 32.62,11.4 32.62,10.9 32.87,10.65 USBC1.B7
$1N8912: length 2.9
  Top Layer w0.127: v1(15.57,6.19) 15.59,6.18 U4.1 17.33,6.23 R8.1

## Copper pours and planes (outline as drawn; the poured copper is in the pictures)
POWER_GND on Top Layer: 0,22.8 40,22.8 40,0 0,0
POWER_GND on Bottom Layer: 0,22.8 40,22.8 40,0 0,0

## Text on the board
Bottom Silkscreen Layer: C | B | A | JP1a | YAESU：JP2a断 JP2b短 / ICOM：JP2a短 JP2b断 | 断开启用 / 输入衰减 | 非891设备： / JP1a-短接 / JP1b-断AB 短BC | JP2b | JP3 / 短接启用FSKK | 891模式（初始设置）：JP1a-断开、JP1b-AB短接、BC断开 / YAESU模式：JP1a-短接，JP1b-AB断开，BC短接 / ICOM模式：JP1a-短接，JP1b-AB断开，BC短接，JP2a-短接，JP2b断开 / 非891模式启用FSKK控制：JP3-短接 | JP2a | DigiPort-General by BD5HLI, 2025.6 | JLCJLCJLCJLC
Top Silkscreen Layer: Audio & PTT | USB/CAT
